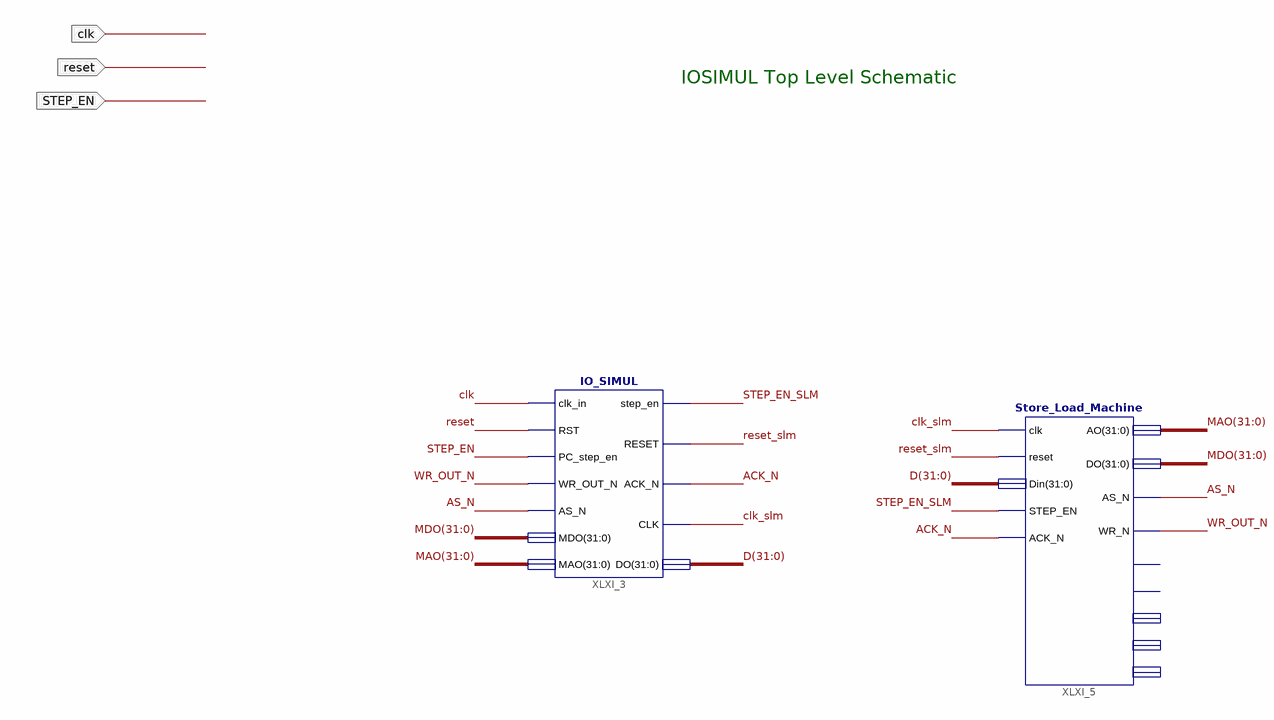
[diagram p0: schematic sheet 1]
// Xilinx ISE schematic TOP_LEVELSIMULIO.sch (spartan6) as structural Verilog: 2 symbols, 3 ports
module TOP_LEVELSIMULIO (
  input  clk,
  input  reset,
  input  STEP_EN
);

  wire ACK_N, AS_N, clk_slm, reset_slm, STEP_EN_SLM, WR_OUT_N;
  wire [31:0] D, MAO, MDO;

  IO_SIMUL XLXI_3 (
    .clk_in(clk), .RST(reset), .PC_step_en(STEP_EN), .WR_OUT_N(WR_OUT_N), .AS_N(AS_N), .MDO(MDO), .MAO(MAO),
    .step_en(STEP_EN_SLM), .RESET(reset_slm), .ACK_N(ACK_N), .CLK(clk_slm), .DO(D));
  Store_Load_Machine XLXI_5 (
    .clk(clk_slm), .reset(reset_slm), .Din(D), .STEP_EN(STEP_EN_SLM), .ACK_N(ACK_N), .AO(MAO), .DO(MDO),
    .AS_N(AS_N), .WR_N(WR_OUT_N));  // open: DLX_State_Control, MAC_State_Control, IN_INIT, STOP_N, PC

  // Notes on the sheet:
  //   IOSIMUL Top Level Schematic
endmodule
